# EAGLE design MultiVS (EAGLE 9.2.0)
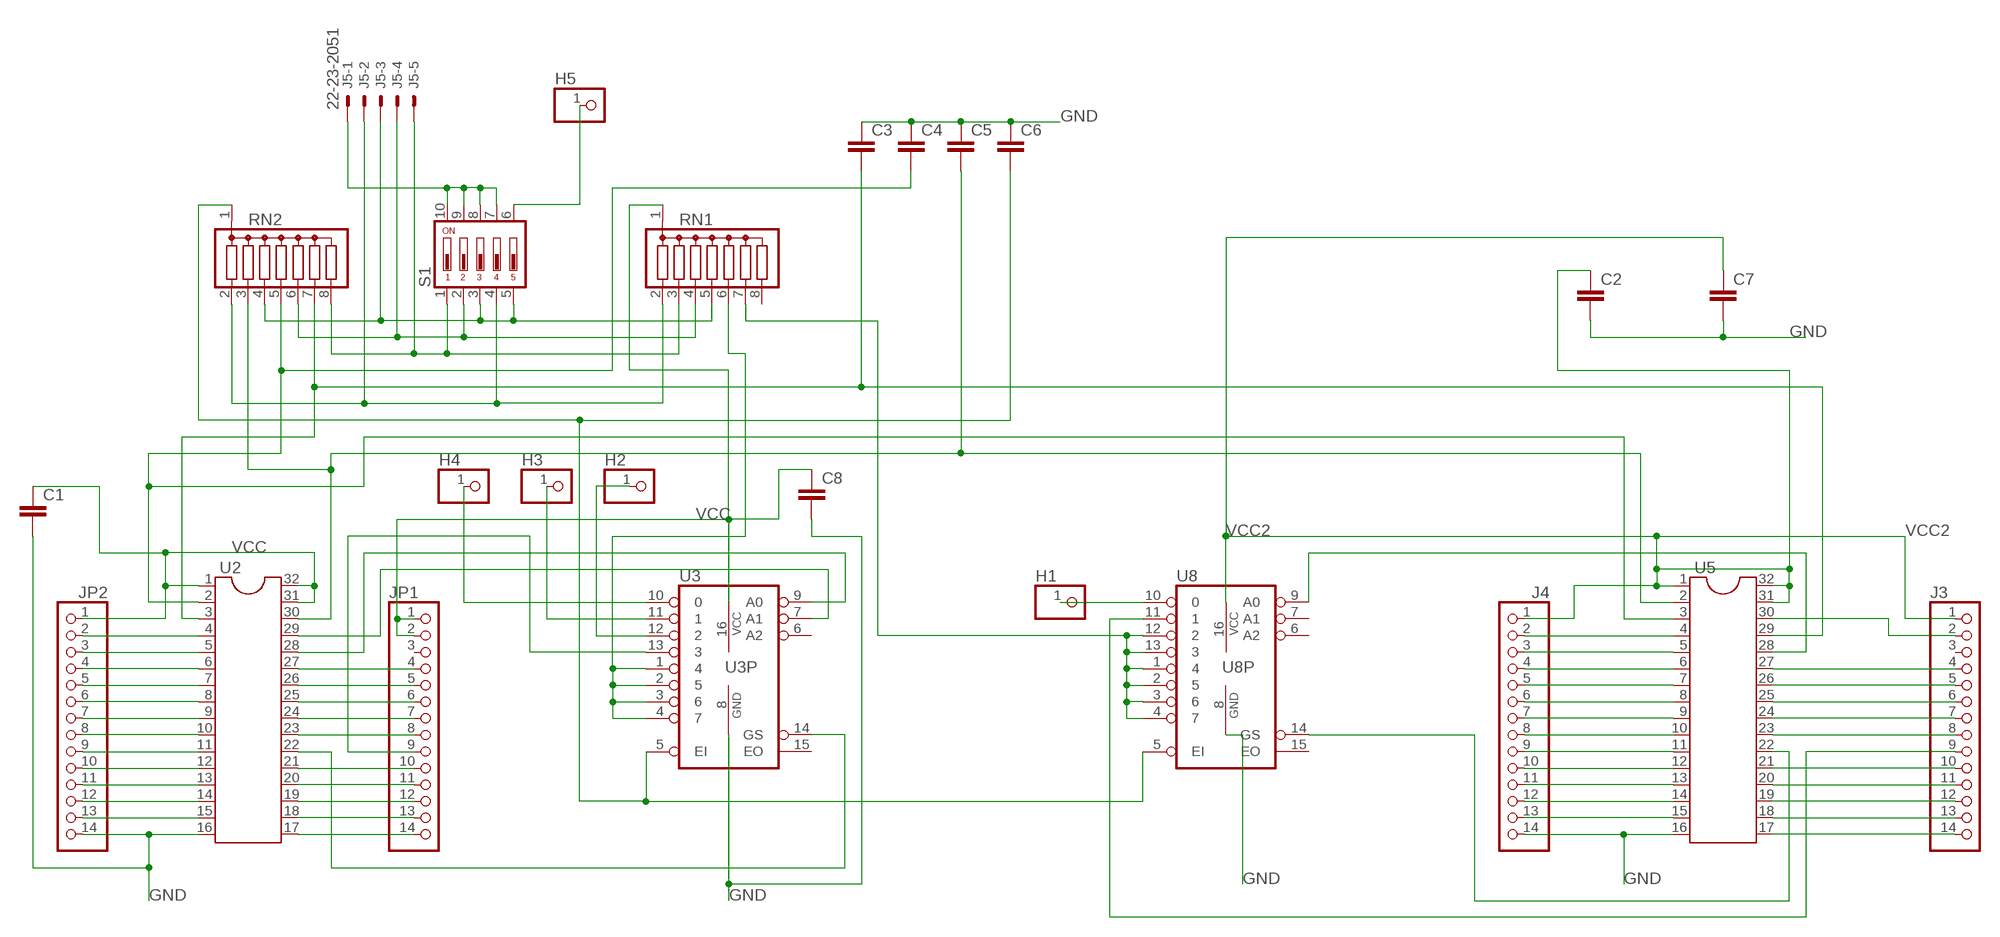
[diagram p0: schematic, sheet 1]

## Parts
C1  C2.5/4  [C2.5-4]
C2  C2.5/4  [C2.5-4]
C3  C2.5/4  [C2.5-4]
C4  C2.5/4  [C2.5-4]
C5  C2.5/4  [C2.5-4]
C6  C2.5/4  [C2.5-4]
C7  C2.5/4  [C2.5-4]
C8  C2.5/4  [C2.5-4]
H1  PINHD-1X1  [1X01]
H2  PINHD-1X1  [1X01]
H3  PINHD-1X1  [1X01]
H4  PINHD-1X1  [1X01]
H5  PINHD-1X1  [1X01]
J3  PINHD-1X14  [1X14]
J4  PINHD-1X14  [1X14]
J5  22-23-2051  [22-23-2051]
JP1  PINHD-1X14  [1X14]
JP2  PINHD-1X14  [1X14]
RN1  G07R  [SIL8]
RN2  G07R  [SIL8]
S1  DIP05YL  [DIP05YL]
U2  DIL32  [DIL32]
U3  74LS148N  [DIL16]
U5  DIL32  [DIL32]
U8  74LS148N  [DIL16]

## Nets
GND: C1.2 C2.2 C3.1 C4.1 C5.1 C6.1 C7.2 C8.2 J4.14 JP2.14 U2.16 U3.8(GND) U5.16 U8.8(GND)
N$1: H1.1 U8.10
N$2: H2.1 U3.12
N$3: H3.1 U3.11
N$4: H4.1 U3.10
N$5: H5.1 S1.6
N$6: JP2.13 U2.15
N$7: JP2.12 U2.14
N$8: JP2.11 U2.13
N$9: JP2.10 U2.12
N$10: JP2.9 U2.11
N$11: JP2.8 U2.10
N$12: JP2.7 U2.9
N$13: JP2.6 U2.8
N$14: JP2.5 U2.7
N$15: JP2.4 U2.6
N$16: JP2.3 U2.5
N$17: J5.5 RN1.3 RN2.8 S1.1
N$18: JP2.2 U2.4
N$19: C3.2 RN2.7 U2.3 U5.29
N$20: JP1.14 U2.17
N$21: JP1.13 U2.18
N$22: JP1.12 U2.19
N$23: JP1.11 U2.20
N$24: JP1.10 U2.21
N$25: JP1.9 U3.13
N$26: JP1.8 U2.23
N$27: U2.22 U3.14(GS)
N$28: JP1.7 U2.24
N$29: JP1.6 U2.25
N$30: JP1.5 U2.26
N$31: JP1.4 U2.27
N$32: U2.28 U3.9(A0)
N$33: U2.29 U3.7(A1)
N$35: C4.2 RN2.5 U2.2 U5.3
N$36: C5.2 RN2.3 U2.30 U5.2
N$37: RN1.6 U3.1 U3.2 U3.3 U3.4
N$38: C6.2 RN2.1 U3.5(EI) U8.5(EI)
N$39: U5.28 U8.9(A0)
N$40: J3.2 U5.30
N$41: J5.1 S1.7 S1.8 S1.9 S1.10
N$42: J5.4 RN1.4 RN2.6 S1.2
N$43: J5.3 RN1.5 RN2.4 S1.3 S1.5
N$44: RN1.7 U8.1 U8.2 U8.3 U8.4 U8.12 U8.13
N$45: J3.9 U8.11
N$46: J4.13 U5.15
N$47: J4.12 U5.14
N$48: J5.2 RN1.2 RN2.2 S1.4
N$49: J4.11 U5.13
N$50: J4.10 U5.12
N$51: J4.9 U5.11
N$52: J4.8 U5.10
N$53: J4.7 U5.9
N$54: J4.6 U5.8
N$55: J4.5 U5.7
N$56: J4.4 U5.6
N$57: J4.3 U5.5
N$58: J4.2 U5.4
N$59: J3.14 U5.17
N$60: J3.13 U5.18
N$61: J3.12 U5.19
N$62: J3.11 U5.20
N$63: J3.10 U5.21
N$64: U5.22 U8.14(GS)
N$65: J3.8 U5.23
N$66: J3.7 U5.24
N$67: J3.6 U5.25
N$68: J3.5 U5.26
N$69: J3.4 U5.27
VCC: C1.1 C8.1 JP1.1 JP1.2 JP2.1 RN1.1 U2.1 U2.31 U2.32 U3.16(VCC)
VCC2: C2.1 C7.1 J3.1 J4.1 U5.1 U5.31 U5.32 U8.16(VCC)
Unconnected: J3.3 JP1.3 RN1.8 U3.6(A2) U3.15(EO) U8.6(A2) U8.7(A1) U8.15(EO)

## Library data of the parts
C1-C8 = capacitor-wima:C: CAPACITOR naming: grid - package width
H1-H5 = pinhead:PINHD-1X1: PIN HEADER
J3 J4 JP1 JP2 = pinhead:PINHD-1X14: PIN HEADER
J5 = con-molex:22-23-2051: .100" (2.54mm) Center Header - 5 Pin; MF: MOLEX; MPN: 22-23-2051; OC_FARNELL: 1462952; OC_NEWARK: 38C9178
RN1 RN2 = resistor-sil:G07R: SIL RESISTOR; OC_FARNELL: unknown; OC_NEWARK: unknown
S1 = switch-dil:DIP05YL: DIL/CODE SWITCH; OC_FARNELL: unknown; OC_NEWARK: unknown
U2 U5 = ic-package:DIL32: Dual In Line
U3 U8 = 74xx-us:74*148: 10-line to 4-line and 8-line to 3-line PRIORITY ENCODER

## Net classes
0 default: width 0.254 mm

## Board
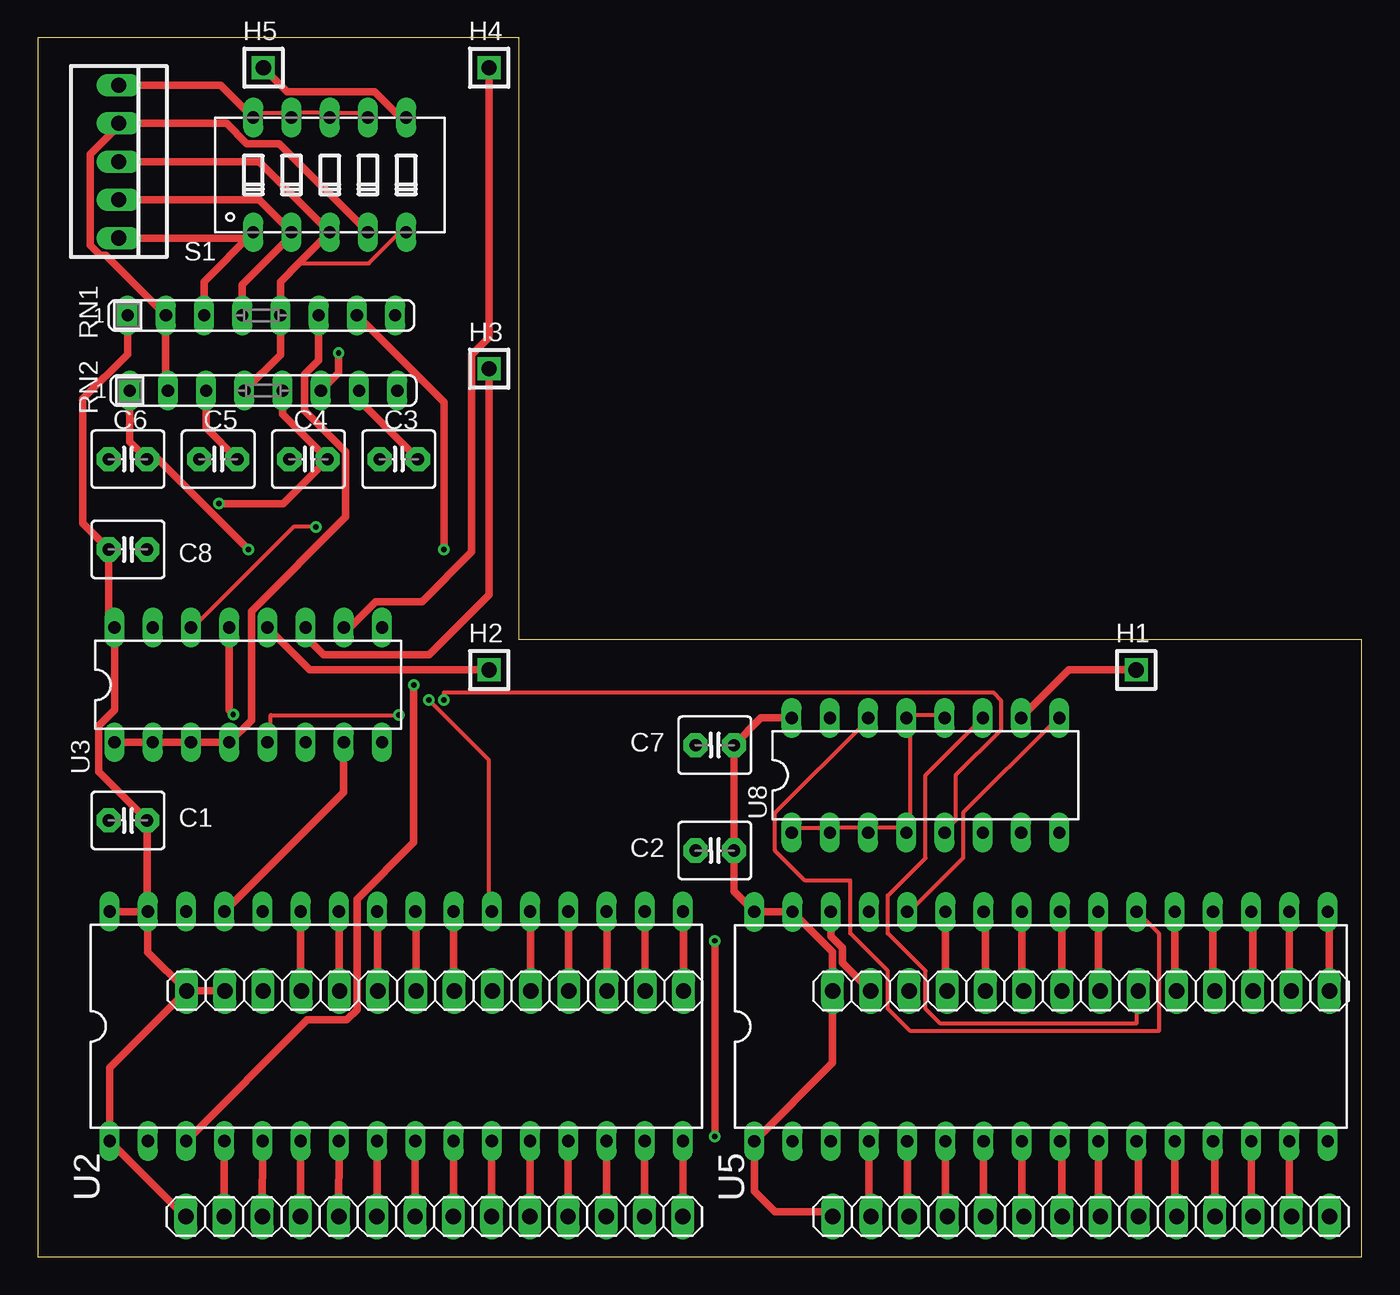
[diagram p1: board, top side]
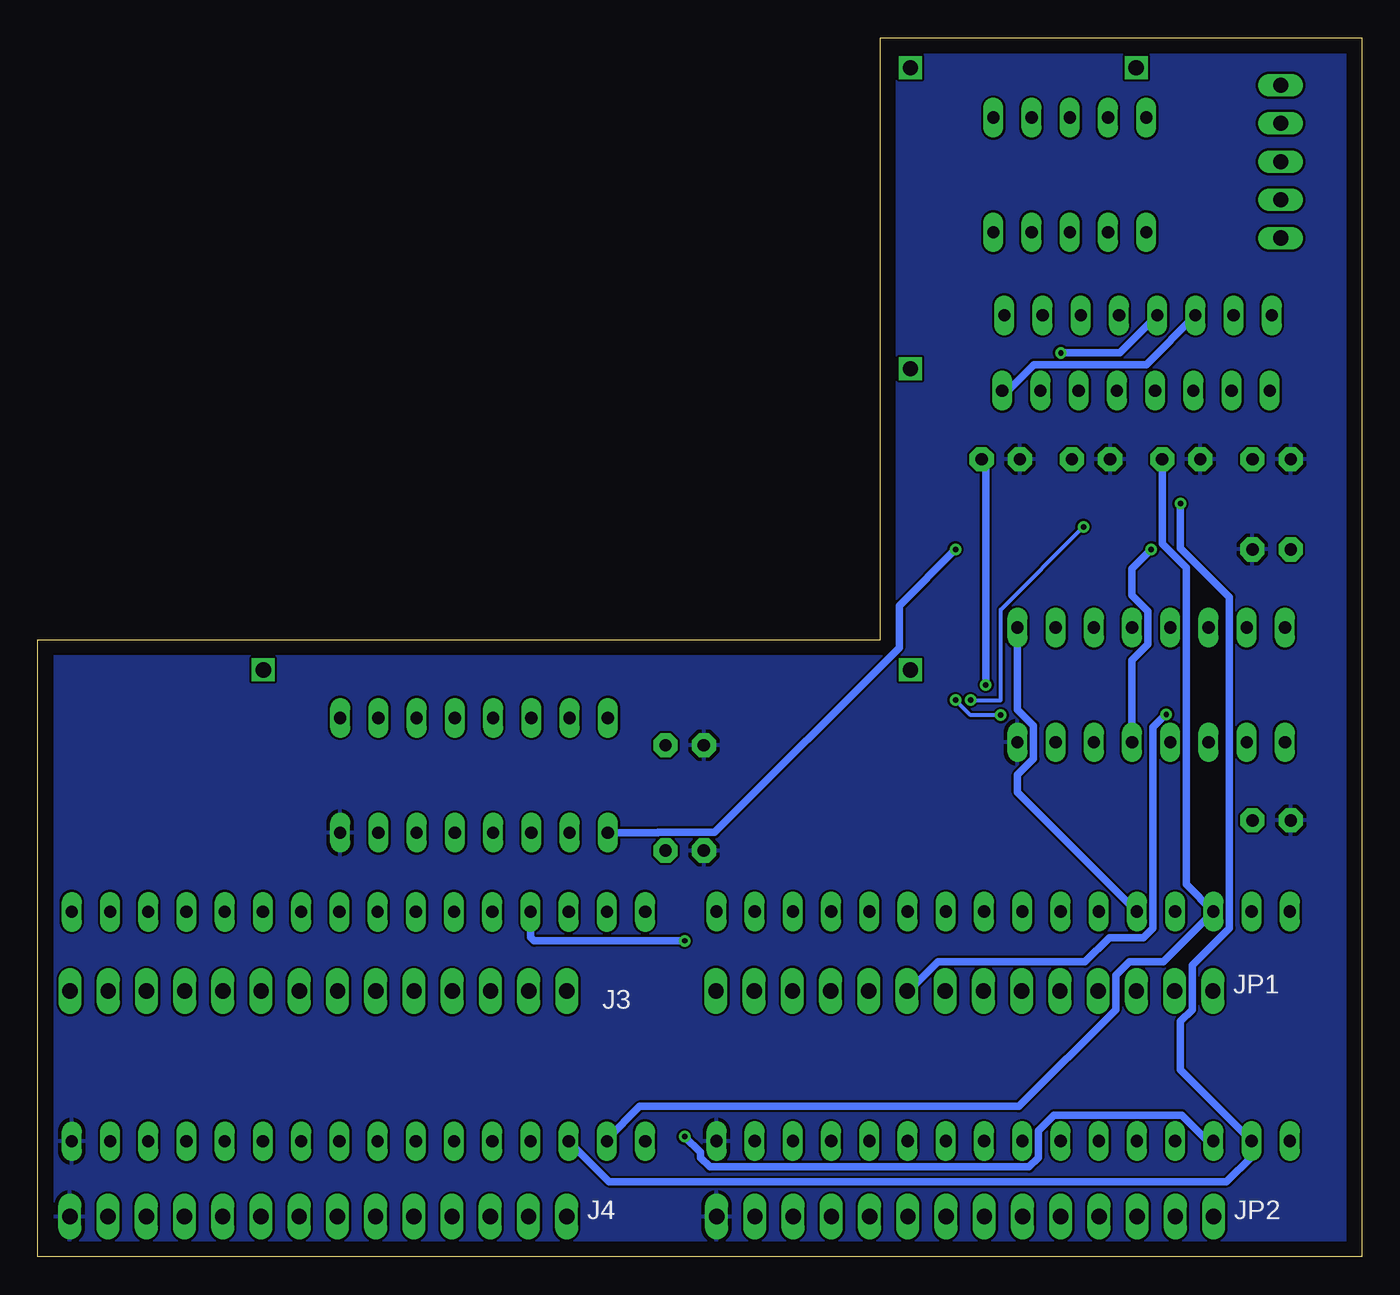
[diagram p2: board, bottom side, seen from below]

Size 88 x 81 mm. Coordinates in mm from the lower left corner, seen from the top.
Outline: 0,0 88,0 88,41 32,41 32,81 0,81 0,0
Copper layers (1*16): Top 0.035mm / dielectric 1.5mm / Bottom 0.035mm
Design rules "default": minimum track width 6mil, minimum drill 0.35mm, track to track 6mil, track to pad 6mil, pad to pad 6mil, via to via 6mil, smd to smd 6mil, copper to edge 40mil, drill to drill 6mil, minimum pad ring 10mil, minimum via ring 8mil, stop-mask expansion 4mil, vias tented up to drill 0mil, thermal gap 10mil

### Footprints (pad centres in the part's own frame; a part is rotated, then mirrored left to right if it is on the bottom)
C2.5-4 = drill 0.813 pad 1.6 octagon: 1 -1.27,0; 2 1.27,0
1X01 = drill 1.016 square: 1 0,0
1X14 = drill 1.016 long: 1 -16.51,0; 2 -13.97,0; 3 -11.43,0; 4 -8.89,0; 5 -6.35,0; 6 -3.81,0; 7 -1.27,0; 8 1.27,0; 9 3.81,0; 10 6.35,0; 11 8.89,0; 12 11.43,0; 13 13.97,0; 14 16.51,0
22-23-2051 = drill 1 long: 1 -5.08,0; 2 -2.54,0; 3 0,0; 4 2.54,0; 5 5.08,0
SIL8 = drill 0.813 long: 1 -8.89,0; 2 -6.35,0; 3 -3.81,0; 4 -1.27,0; 5 1.27,0; 6 3.81,0; 7 6.35,0; 8 8.89,0
DIP05YL = drill 0.813 long: 1 -5.08,-3.81; 2 -2.54,-3.81; 3 0,-3.81; 4 2.54,-3.81; 5 5.08,-3.81; 6 5.08,3.81; 7 2.54,3.81; 8 0,3.81; 9 -2.54,3.81; 10 -5.08,3.81
DIL32 = drill 0.813 long: 1 -19.05,-7.62; 2 -16.51,-7.62; 3 -13.97,-7.62; 4 -11.43,-7.62; 5 -8.89,-7.62; 6 -6.35,-7.62; 7 -3.81,-7.62; 8 -1.27,-7.62; 9 1.27,-7.62; 10 3.81,-7.62; 11 6.35,-7.62; 12 8.89,-7.62; 13 11.43,-7.62; 14 13.97,-7.62; 15 16.51,-7.62; 16 19.05,-7.62; 17 19.05,7.62; 18 16.51,7.62; 19 13.97,7.62; 20 11.43,7.62; 21 8.89,7.62; 22 6.35,7.62; 23 3.81,7.62; 24 1.27,7.62; 25 -1.27,7.62; 26 -3.81,7.62; 27 -6.35,7.62; 28 -8.89,7.62; 29 -11.43,7.62; 30 -13.97,7.62; 31 -16.51,7.62; 32 -19.05,7.62
DIL16 = drill 0.813 long: 1 -8.89,-3.81; 2 -6.35,-3.81; 3 -3.81,-3.81; 4 -1.27,-3.81; 5 1.27,-3.81; 6 3.81,-3.81; 7 6.35,-3.81; 8 8.89,-3.81; 9 8.89,3.81; 10 6.35,3.81; 11 3.81,3.81; 12 1.27,3.81; 13 -1.27,3.81; 14 -3.81,3.81; 15 -6.35,3.81; 16 -8.89,3.81

### Placement (x,y rotation side)
C1  6,29 180 top
C2  45,27 180 top
C3  24,53 0 top
C4  18,53 0 top
C5  12,53 0 top
C6  6,53 0 top
C7  45,34 180 top
C8  6,47 0 top
H1  73,39 0 top
H2  30,39 0 top
H3  30,59 0 top
H4  30,79 0 top
H5  15,79 0 top
J3  69.34,17.66 0 top
J4  69.35,2.69 0 top
J5  5.4,72.77 270 top
JP1  26.41,17.68 0 top
JP2  26.36,2.68 0 top
RN1  14.87,62.55 0 top
RN2  15.01,57.55 0 top
S1  19.41,71.88 0 top
U2  23.84,15.32 0 top
U3  14,38 0 top
U5  66.67,15.3 0 top
U8  59,32 0 top

### Tracks (layer width: path | path; a pad name or v marks a point on that pad's centre or on a via)
GND
  Top 0.5: JP2.14 42.89,2.7 U2.16
  pour Bottom: 1,80 1,1 87,1 87,40 31,40 31,80
N$1
  Top 0.5: H1.1 68.54,39 U8.10
N$2
  Top 0.5: H2.1 18.08,39 U3.12
N$3
  Top 0.5: H3.1 30,44 26,40 19,40 18,41 18,41.62 U3.11
N$4
  Top 0.5: H4.1 30,61.09 28.84,59.93 28.84,46.84 25.53,43.53 22.45,43.53 20.73,41.81 U3.10
N$5
  Top 0.5: H5.1 16.59,77.41 22.39,77.41 24.11,75.69 S1.6
N$6
  Top 0.5: JP2.13 40.33,7.69 U2.15
N$7
  Top 0.5: JP2.12 37.79,7.69 U2.14
N$8
  Top 0.5: JP2.11 35.25,7.69 U2.13
N$9
  Top 0.5: U2.12 32.73,2.7 JP2.10
N$10
  Top 0.5: JP2.9 30.17,7.69 U2.11
N$11
  Top 0.5: U2.10 27.65,2.7 JP2.8
N$12
  Top 0.5: JP2.7 25.09,7.69 U2.9
N$13
  Top 0.5: JP2.6 U2.8
N$14
  Top 0.5: JP2.5 U2.7
N$15
  Top 0.5: JP2.4 U2.6
N$16
  Top 0.5: JP2.3 U2.5
N$17
  Top 0.5: J5.5 13.95,67.69 S1.1 11.06,64.8 RN1.3
  Bottom 0.5: RN1.3 14.34,59.27 21.8,59.27 23.52,57.55 RN2.8
N$18
  Top 0.5: JP2.2 U2.4
N$19  (via drill 0.35)
  Top 0.5: RN2.7 21.36,56.91 C3.2 | U2.3 17.91,15.75 20.55,15.75 21.23,16.43 21.23,23.77 25,27.54 v25,38 | v45,8 v45,21
  Bottom 0.5: v25,38 25,52.73 C3.2 | U2.3 10.24,7.7 11.97,9.43 20.47,9.43 21.5,8.39 21.5,6.6 22.13,5.98 43.33,5.98 43.95,6.6 43.95,6.95 v45,8 | v45,21 55,21 55.24,21.25 U5.29
N$20
  Top 0.5: JP1.14 42.92,22.91 U2.17
N$21
  Top 0.5: U2.18 40.35,17.72 JP1.13
N$22
  Top 0.5: JP1.12 37.84,22.91 U2.19
N$23
  Top 0.5: U2.20 35.27,17.72 JP1.11
N$24
  Top 0.5: JP1.10 32.77,22.91 U2.21
N$25  (via drill 0.35)
  Top 0.5: U3.13 12.73,36.31 v13,36.04
  Bottom 0.5: v13,36.04 13.13,35.91 13.17,35.91 13.88,35.2 13.88,21.84 14.51,21.22 16.78,21.22 18.4,19.6 28.17,19.6 30.09,17.68 JP1.9
N$26
  Top 0.5: U2.23 27.65,17.72 JP1.8
N$27  (via drill 0.35)
  Top 0.254: v18.5,48.5 17,48.5 10.5,42 U3.14 | v26,37 30,33 30,23 U2.22
  Bottom 0.254: v18.5,48.5 24,43 24,37 v26,37
N$28
  Top 0.5: JP1.7 25.14,22.91 U2.24
N$29
  Top 0.5: U2.25 22.61,22.91 JP1.6
N$30
  Top 0.5: JP1.5 20.03,17.72 U2.26
N$31
  Top 0.5: U2.27 17.49,17.72 JP1.4
N$32
  Bottom 0.5: U2.28 22.89,30.89 22.89,32.03 21.83,33.09 21.83,35.29 22.89,36.35 U3.9
N$33
  Top 0.5: U2.29 20.35,30.89 U3.7
N$35  (via drill 0.35)
  Top 0.5: RN2.5 16.28,55.99 C4.2 16.32,50.05 v12.05,50.05
  Bottom 0.5: U5.3 50.02,5 9,5 7.33,6.67 U2.2 12.05,12.43 12.05,15.66 11.28,16.43 11.28,19.37 8.8,21.84 8.8,43.83 12.05,47.08 v12.05,50.05
N$36
  Top 0.5: RN2.3 11.2,55.07 C5.2
  Bottom 0.5: C5.2 13.27,47.37 11.67,45.77 11.67,24.74 U2.30 13.21,19.6 15.47,19.6 16.36,18.71 16.36,16.43 22.79,10 48,10 50.16,7.83 U5.2
N$37
  Top 0.5: RN1.6 18.68,59.57 17.76,58.65 17.76,56.21 20.47,53.5 20.47,49.18 14.21,42.91 14.21,35.67 U3.4 U3.3 U3.2 U3.1
N$38  (via drill 0.35)
  Top 0.254: v27,37 27,37.5 63.5,37.5 64,37 64,35 61,32 61,29 60.5,28.5 U8.5 | v24,36 15.5,36 15.5,34.5 U3.5
  Top 0.5: RN2.1 6.12,54.15 C6.2 8,53 v14,47
  Bottom 0.254: v27,37 26,36 v24,36
  Bottom 0.5: v14,47 15.27,45.73 15.27,43.97 14.21,42.91 14.21,40.71 15.27,39.65 U3.5
N$39
  Top 0.254: U5.28 58,23 61.5,26.5 61.5,29.5 67.5,35.5 U8.9
N$40
  Top 0.5: J3.2 53.48,19.55 53.48,20.53 52.7,21.31 U5.30
N$41
  Top 0.254: S1.7 21.5,76 19.5,76 S1.8 19,76 17,76 S1.9 16.5,76 14.5,76 S1.10
  Top 0.5: S1.10 12.17,77.85 J5.1
N$42  (via drill 0.35)
  Top 0.5: J5.4 14.71,70.23 S1.2 16.87,67.87 13.6,64.6 RN1.4 | v20,60.05 20,58.73 RN2.6
  Bottom 0.5: RN1.4 16.1,60.05 v20,60.05
N$43
  Top 0.254: S1.5 24,68 22,66 17.5,66 17.42,66.08
  Top 0.5: J5.3 14.71,72.77 S1.3 17.42,66.08 16.14,64.8 RN1.5 16.14,59.95 RN2.4
N$44  (via drill 0.35)
  Top 0.254: U8.12 60,36 58,36 U8.13 58,35.5 58,28.5 U8.4 57.5,28.5 55.5,28.5 U8.3 55,28.5 53,28.5 U8.2 52.5,28.5 50.5,28.5 U8.1
  Top 0.5: RN1.7 27,56.77 v27,47
  Bottom 0.5: v27,47 30.73,43.27 30.73,40.48 43.01,28.2 46.77,28.2 46.78,28.19 U8.1
N$45
  Top 0.254: U8.11 59,32 59,26.5 56.5,24 56.5,21.5 59,19 59,16.5 60,15.5 73,15.5 73,17.5 J3.9
N$46
  Top 0.5: J4.13 83.19,2.82 U5.15
N$47
  Top 0.5: U5.14 80.64,2.82 J4.12
N$48
  Top 0.5: S1.4 16.05,73.97 13.89,73.97 12.55,75.31 J5.2 5.4,75.16 3.49,73.25 3.49,67.21 4.17,66.53 4.54,66.53 RN1.2 8.52,57.69 RN2.2
N$49
  Top 0.5: J4.11 78.24,7.55 U5.13
N$50
  Top 0.5: U5.12 75.56,2.82 J4.10
N$51
  Top 0.5: J4.9 73.16,7.55 U5.11
N$52
  Top 0.5: U5.10 70.48,2.82 J4.8
N$53
  Top 0.5: J4.7 68.08,7.55 U5.9
N$54
  Top 0.5: U5.8 65.41,2.82 J4.6
N$55
  Top 0.5: U5.7 62.87,2.82 J4.5
N$56
  Top 0.5: U5.6 60.33,2.82 J4.4
N$57
  Top 0.5: U5.5 57.78,2.82 J4.3
N$58
  Top 0.5: U5.4 55.24,2.82 J4.2
N$59
  Top 0.5: J3.14 85.85,22.8 U5.17
N$60
  Top 0.5: U5.18 83.19,17.78 J3.13
N$61
  Top 0.5: J3.12 80.77,22.8 U5.19
N$62
  Top 0.5: U5.20 78.11,17.78 J3.11
N$63
  Top 0.5: J3.10 75.56,17.78 U5.21
N$64
  Top 0.254: U8.14 55,35.5 49,29.5 49,27 51,25 54,25 54,21.5 56.5,19 56.5,16.5 58,15 74.5,15 74.5,21.5 73.5,22.5 U5.22
N$65
  Top 0.5: U5.23 70.48,17.78 J3.8
N$66
  Top 0.5: J3.7 68.07,22.8 U5.24
N$67
  Top 0.5: U5.25 65.41,17.78 J3.6
N$68
  Top 0.5: J3.5 62.99,22.8 U5.26
N$69
  Top 0.5: U5.27 60.33,17.78 J3.4
VCC
  Top 0.5: U2.31 7.27,23 C1.1 4.05,32.22 4.05,35.29 5.11,36.35 U3.16 4.73,42.19 C8.1 3,48.73 3,57 5.98,59.98 RN1.1 | U2.31 U2.32 | U2.31 7.33,20.26 JP1.1 | JP1.1 4.79,12.56 U2.1 9.81,2.68 JP2.1 | JP1.2 JP1.1
VCC2
  Top 0.5: U8.16 48.08,35.81 C7.1 C2.1 46.27,24.28 U5.32 U5.31 52.83,20.26 J3.1 52.83,12.89 U5.1 47.62,4.38 49,3 52.52,3 J4.1